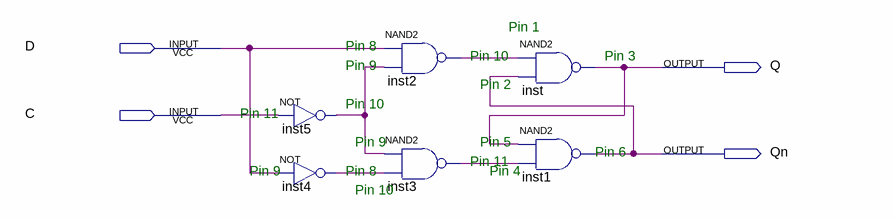
[diagram p0: schematic sheet]
// Quartus schematic d_latch.bdf as structural Verilog: 6 symbols, 4 pins
module d_latch (
  input  D,
  input  C,
  output Q,
  output Qn
);

  wire inst2_out, inst3_out, inst4_out, inst5_out;

  not inst5 (inst5_out, C);
  not inst4 (inst4_out, D);
  nand inst2 (inst2_out, D, inst5_out);
  nand inst3 (inst3_out, inst5_out, inst4_out);
  nand inst (Q, inst2_out, Qn);
  nand inst1 (Qn, Q, inst3_out);

  // Notes on the sheet:
  //   Pin 1
  //   Pin 8
  //   Pin 10
  //   Pin 3
  //   Pin 9
  //   Pin 2
  //   Pin 10
  //   Pin 11
  //   Pin 9
  //   Pin 5
  //   Pin 6
  //   Pin 11
  //   Pin 9
  //   Pin 8
  //   Pin 4
  //   Pin 10
endmodule
